# Altium project asincronico.PrjPcb
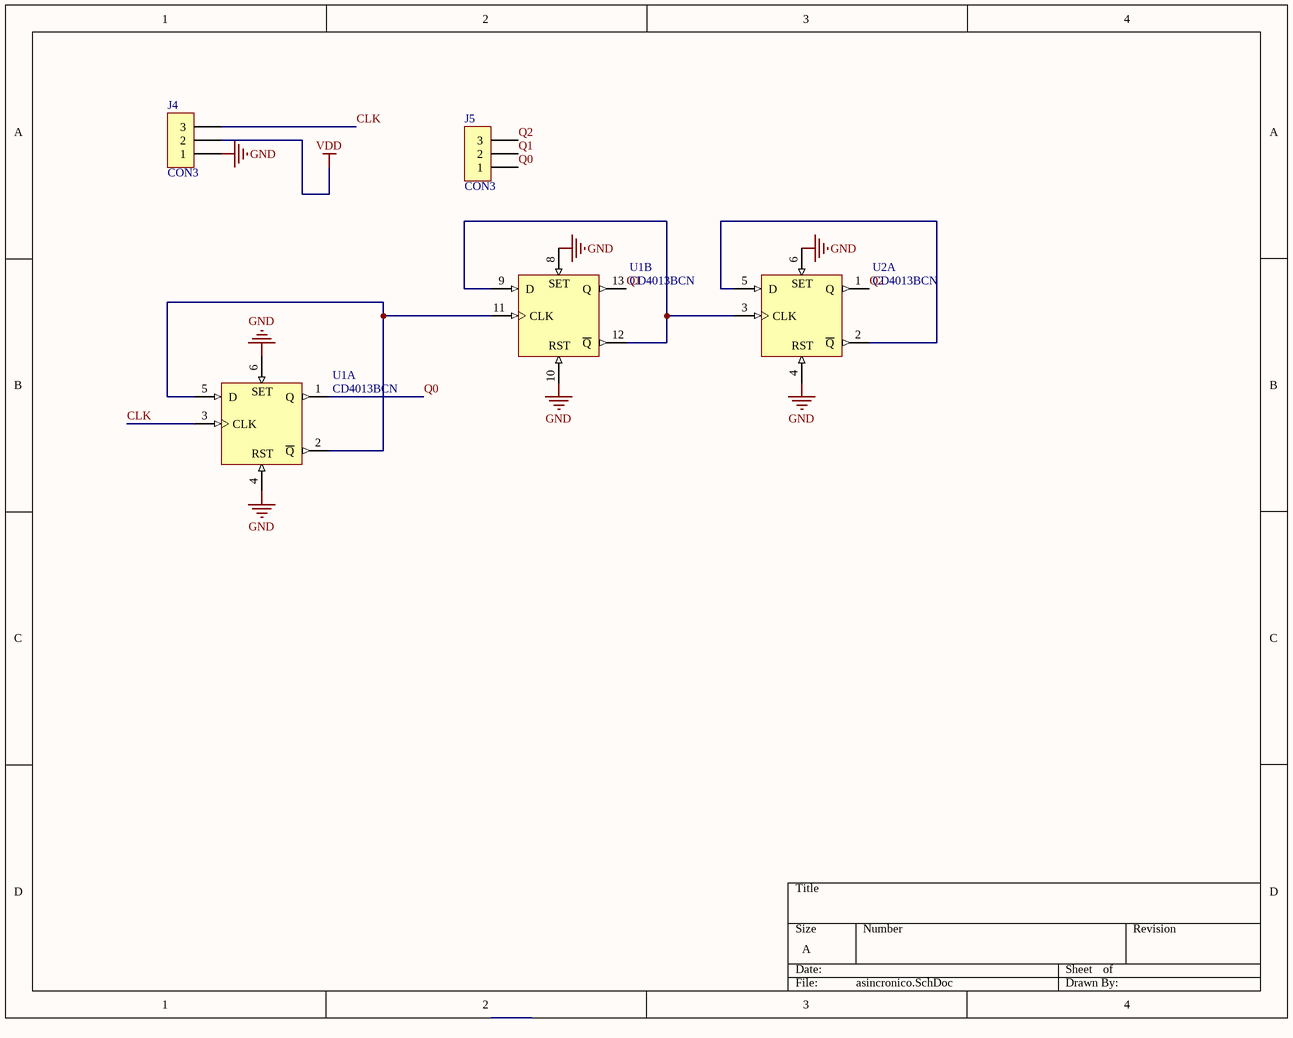
[diagram p0: asincronico.SchDoc]
1 sheet, 4 parts. Net scope: global (net labels, ports and power ports of the same name join across sheets).
Board file: asincronico.PcbDoc

## Sheet asincronico.SchDoc
size A

### Parts
J4  CON3  [SIP3]
J5  CON3  [SIP3]
U1  CD4013BCN  [N14A]  (parts A,B of 2)
U2  CD4013BCN  [N14A]  (part A of 2)

### Nets
GND: J4.1 U1.4(RST) U1.6(S) U1.7(GND) U1.8(S) U1.10(RST) U2.4(RST) U2.6(S) U2.7(GND)
VDD: J4.2 U1.14(VDD) U2.14(VDD)
CLK: J4.3 U1.3(CLK)
Q0: J5.1 U1.1(Q)
Q1: J5.2 U1.13(Q)
Q2: J5.3 U2.1(Q)
NetU1_2: U1.2(~{Q}) U1.5(D) U1.11(CLK)
NetU1_9: U1.9(D) U1.12(~{Q}) U2.3(CLK)
NetU2_2: U2.2(~{Q}) U2.5(D)

### Notes on the sheet
- (in symbol CD4013BCN, part A) SET
- (in symbol CD4013BCN, part B) SET

### Library data of the parts
U1 U2 = CD4013BCN: Dual D-Type Flip-Flop; Published: 17-Jul-2002; LatestRevisionDate: 29-May-2009; LatestRevisionNote: Component Body Added.; DatasheetVersion: Jan-1999; PackageVersion: 2000; PackageReference: N14A; Publisher: Altium Limited; PackageDescription: DIP, 14-Pin, Row Spacing 7.62 mm, Pitch 2.54 mm; ComponentLink1Description: Manufacturer Link; ComponentLink1URL: http://www.fairchildsemi.com/